# EAGLE design GBC USB-C Charging Kit Pro (EAGLE 6.2)
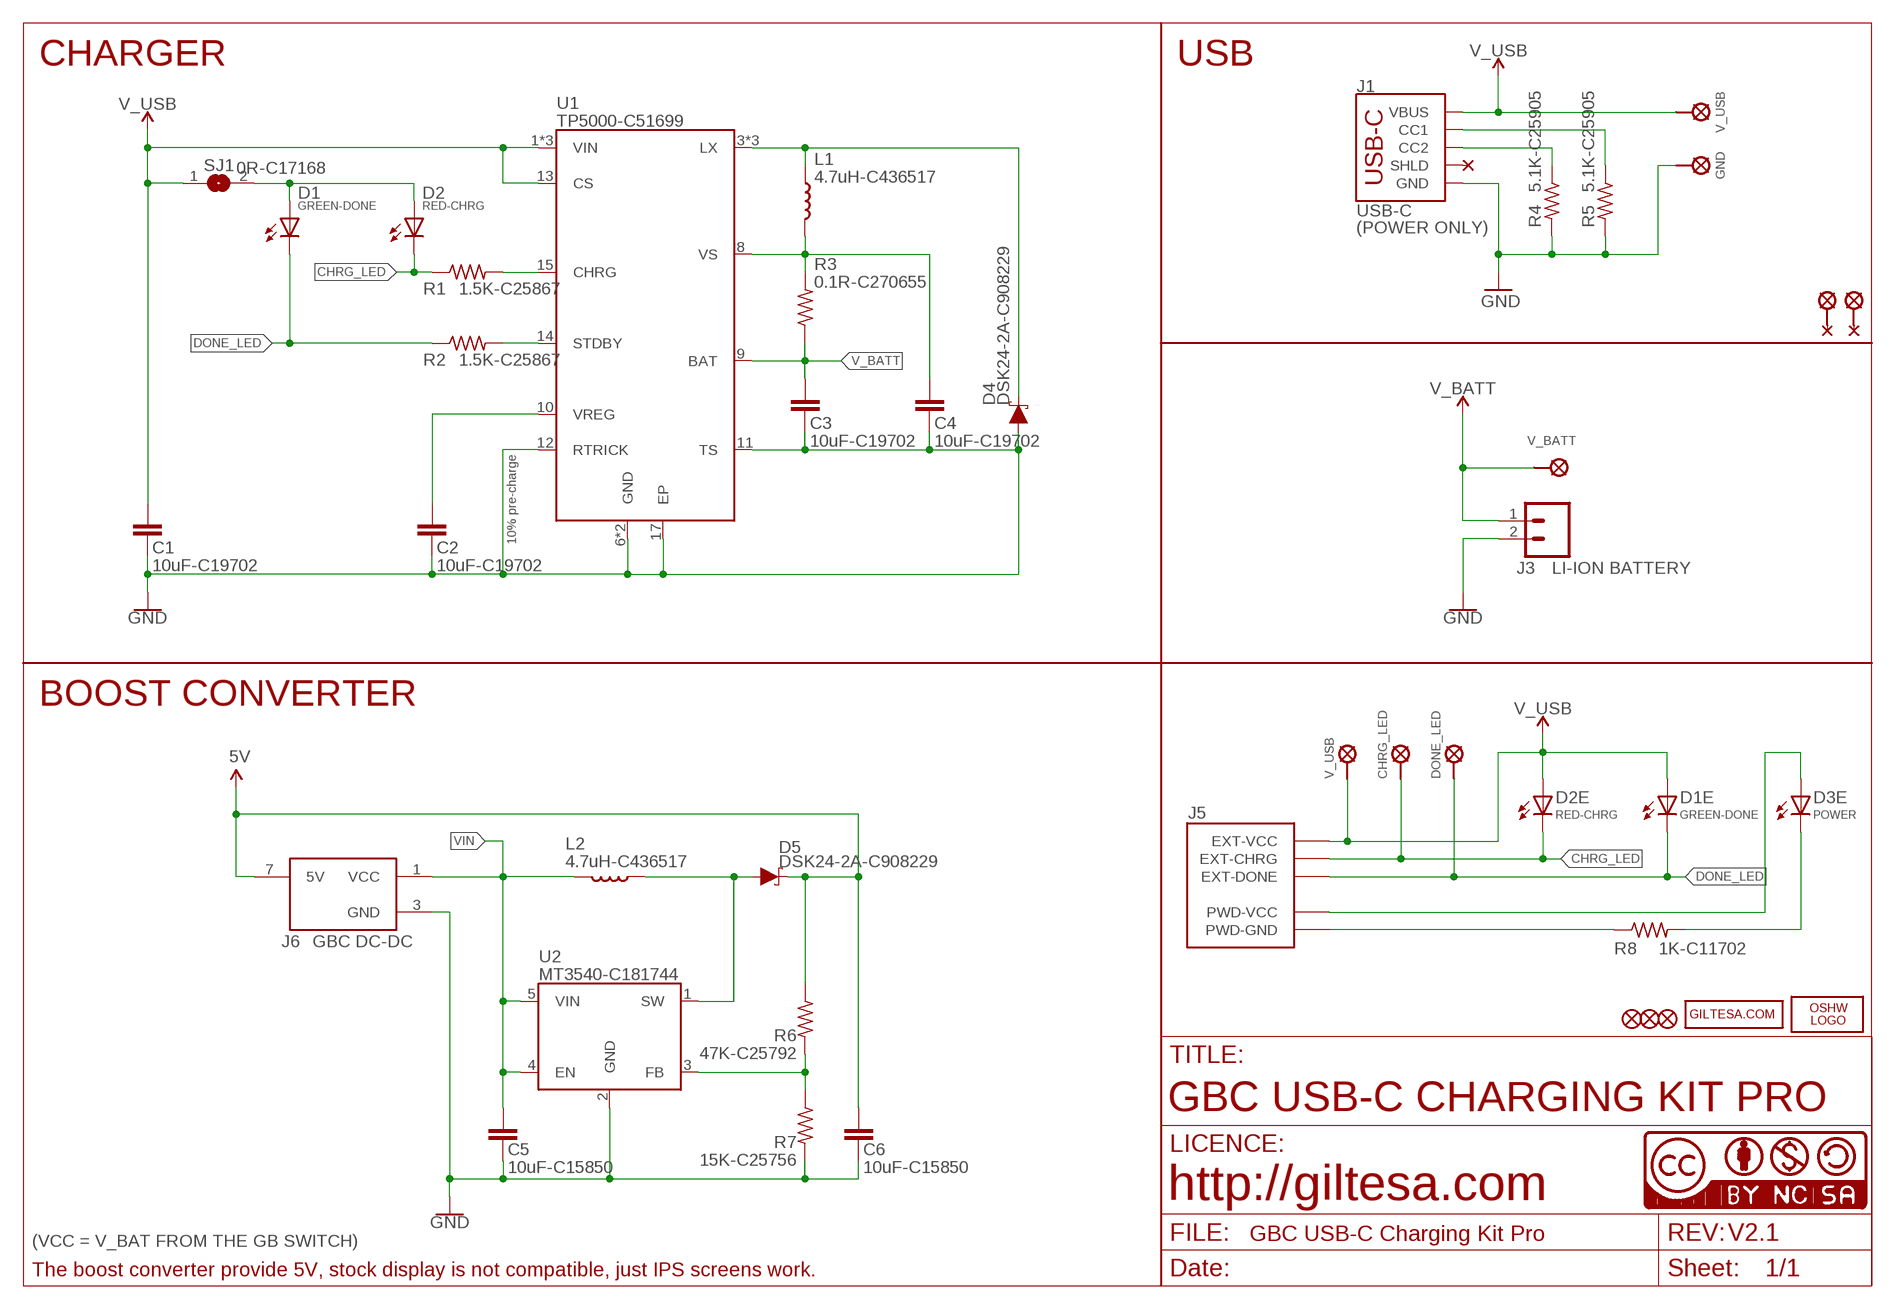
[diagram p0: schematic, sheet 1, part 1 of 2]
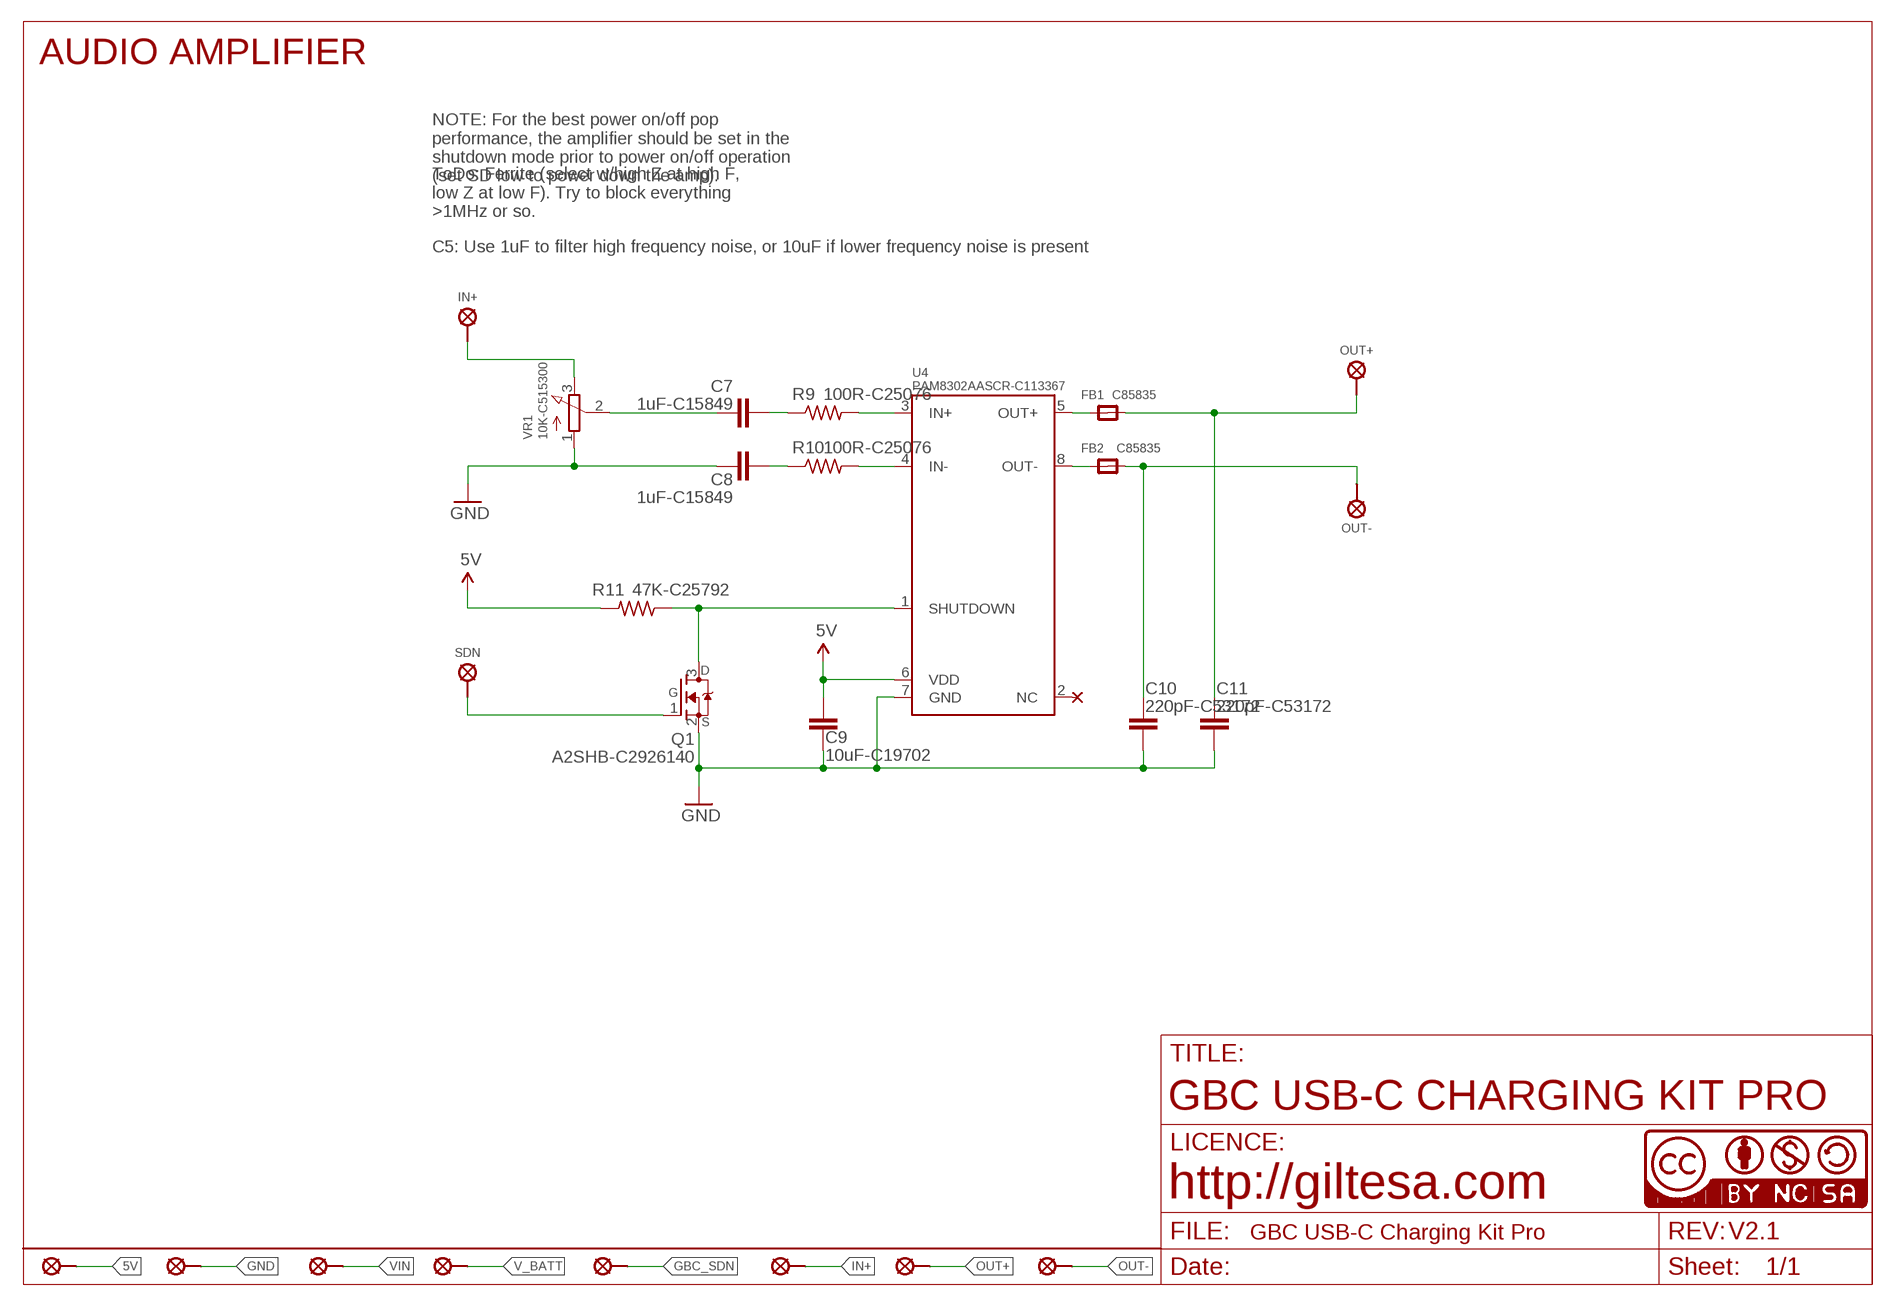
[diagram p1: schematic, sheet 1, part 2 of 2]

## Parts
C1  10uF-C19702  C0603_SMALL  [C0603_S]
C2  10uF-C19702  C0603_SMALL  [C0603_S]
C3  10uF-C19702  C0603_SMALL  [C0603_S]
C4  10uF-C19702  C0603_SMALL  [C0603_S]
C5  10uF-C15850  C0805_SMALL  [C0805_S]
C6  10uF-C15850  C0805_SMALL  [C0805_S]
C7  1uF-C15849  C0603_SMALL  [C0603_S]
C8  1uF-C15849  C0603_SMALL  [C0603_S]
C9  10uF-C19702  C0603_SMALL  [C0603_S]
C10  220pF-C53172  C0805_SMALL  [C0805_S]
C11  220pF-C53172  C0805_SMALL  [C0805_S]
D1  GREEN-DONE  L0402  [L0402]
D1E  GREEN-DONE  L0402  [L0402]
D2  RED-CHRG  L0402  [L0402]
D2E  RED-CHRG  L0402  [L0402]
D3E  POWER  L0402  [L0402]
D4  DSK24-2A-C908229  DIODE-SCHOTTKY_SOD-123FL  [SOD-123FL]
D5  DSK24-2A-C908229  DIODE-SCHOTTKY_SOD-123FL  [SOD-123FL]
FB1  C85835  MICROBUILDER_FERRITE_SMALL  [MICROBUILDER__0805MP_S]
FB2  C85835  MICROBUILDER_FERRITE_SMALL  [MICROBUILDER__0805MP_S]
FD2  FIDUCIALUFIDUCIAL  [FIDUCIAL-MICRO]
FD3  FIDUCIALUFIDUCIAL  [FIDUCIAL-MICRO]
FD4  FIDUCIALUFIDUCIAL  [FIDUCIAL-MICRO]
J1  USB-C  USB-CPOWER  [USB-C_6P]
J3  LI-ION BATTERY  JST-21MM  [JST-2-1MM-SMD_RIGHT]
J5  GBC_LED  [GBC_LED]
J6  GBC DC-DC  GBC_DC_DCDIP  [GBC_DC_DC_DIP]
L1  4.7uH-C436517  INDUCTOR_2  [PSPMAA0402]
L2  4.7uH-C436517  INDUCTOR_2  [PSPMAA0402]
LOGO2  OSHW_LOGO_FILLX0150-NT  [OSHW_FILLX150_NOTEXT]
PP1  SOLDER_PAD-1.5  [SOLDER_PAD_1.5]
PP2  SOLDER_PAD-1.5  [SOLDER_PAD_1.5]
PP3  SOLDER_PAD-1.5  [SOLDER_PAD_1.5]
PP4  SOLDER_PAD-1.5  [SOLDER_PAD_1.5]
PP5  SOLDER_PAD-1.5  [SOLDER_PAD_1.5]
PP6  SOLDER_PAD-1.5  [SOLDER_PAD_1.5]
PP7  SOLDER_PAD-1.5  [SOLDER_PAD_1.5]
PP8  SOLDER_PAD-1.5  [SOLDER_PAD_1.5]
Q1  A2SHB-C2926140  MOSFET-NCHANNEL_SMALL  [SOT23-3_S]
R1  1.5K-C25867  R0402  [R0402]
R2  1.5K-C25867  R0402  [R0402]
R3  0.1R-C270655  R0402  [R0402]
R4  5.1K-C25905  R0402  [R0402]
R5  5.1K-C25905  R0402  [R0402]
R6  47K-C25792  R0402  [R0402]
R7  15K-C25756  R0402  [R0402]
R8  1K-C11702  R0402  [R0402]
R9  100R-C25076  R0402  [R0402]
R10  100R-C25076  R0402  [R0402]
R11  47K-C25792  R0402  [R0402]
SJ1  0R-C17168  JUMPER-SMD0402  [JUMPER-SMD_0402]
U1  TP5000-C51699  TP5000  [QFN-16_4X4]
U2  MT3540-C181744  MT3540  [SOT-23-5]
U4  PAM8302AASCR-C113367  PAM8302A_ASCR  [PAM8302AASCR]
U$1  V_USB  SOLDER_PAD-1.5  [SOLDER_PAD_1.5]
U$2  SDN  PAD_1.0  [PAD_1.0]
U$3  GND  SOLDER_PAD-1.5  [SOLDER_PAD_1.5]
U$6  CC-BY-NC-SA15MM  [CC-BY-NC-SA_15MM]
U$9  SOLDER_PAD-2.5  [SOLDER_PAD_2.5]
U$16  GILTESA.COM_MASK  [GILTESA.COM_MASK]
U$17  CC-NC-BCNIX  [CC-NC-B_NIX]
U$20  OUT+  SOLDER_PAD-2.0  [SOLDER_PAD_2.0]
U$21  CC-NC-BCNIX  [CC-NC-B_NIX]
U$23  OUT-  SOLDER_PAD-2.0  [SOLDER_PAD_2.0]
U$24  CHRG_LED  SOLDER_PAD-1.3  [SOLDER_PAD_1.3]
U$25  DONE_LED  SOLDER_PAD-1.3  [SOLDER_PAD_1.3]
U$26  V_USB  SOLDER_PAD-1.3  [SOLDER_PAD_1.3]
U$29  V_BATT  PAD_1.25  [PAD_1.25]
U$30  IN+  SOLDER_PAD-1.3  [SOLDER_PAD_1.3]
U$32  SOLDER_PAD-2.5  [SOLDER_PAD_2.5]
VR1  10K-C515300  TRIMPOT3303W/X  [TRIMPOT_BOURNS_3303W]

## Nets
5V: C6.2 C9.1 D5.C J6.7(5V) PP1.P$1 R6.1 R11.2 U4.6(VDD)
CHRG_LED: D2.C D2E.C J5.EXT-CHRG R1.1 U$24.P$1
DONE_LED: D1.C D1E.C J5.EXT-DONE R2.1 U$25.P$1
GBC_SDN: PP5.P$1 Q1.1(G) U$2.P$1
GND: C1.1 C2.1 C3.1 C4.1 C5.1 C6.1 C8.2 C9.2 C10.2 C11.2 D4.A J1.GND1(GND) J1.GND2(GND) J3.2 J6.3(GND) PP2.P$1 Q1.2(S) R4.2 R5.2 R7.2 U1.6(GND) U1.7(GND) U1.11(TS) U1.12(RTRICK) U1.17(EP) U2.2(GND) U4.7(GND) U$3.P$1 VR1.1(A)
IN+: PP6.P$1 U$30.P$1 VR1.3(E)
N$1: D1.A D2.A SJ1.2
N$3: D5.A L2.P$1 U2.1(SW)
N$4: J1.B5(CC2) R4.1
N$6: R1.2 U1.15(CHRG)
N$7: R6.2 R7.1 U2.3(FB)
N$8: J5.PWD-GND R8.1
N$9: R10.2 U4.4(IN-)
N$10: D3E.A J5.PWD-VCC
N$11: D3E.C R8.2
N$12: R9.2 U4.3(IN+)
N$13: J1.A5(CC1) R5.1
N$16: C8.1 R10.1
N$17: FB2.1 U4.8(OUT-)
N$18: C2.2 U1.10(VREG)
N$19: R2.2 U1.14(STDBY)
N$20: C4.2 L1.P$2 R3.2 U1.8(VS)
N$21: D4.C L1.P$1 U1.3(LX) U1.4(LX) U1.5(LX)
N$22: FB1.1 U4.5(OUT+)
N$23: C7.1 R9.1
N$25: C7.2 VR1.2(S)
OUT+: C11.1 FB1.2 PP7.P$1 U$20.P$1
OUT-: C10.1 FB2.2 PP8.P$1 U$23.P$1
SDN: Q1.3(D) R11.1 U4.1(SHUTDOWN)
V_BATT: C3.2 J3.1 PP4.P$1 R3.1 U1.9(BAT) U$29.P$1
V_USB: C1.2 D1E.A D2E.A J1.VBUS1(VBUS) J1.VBUS2(VBUS) J5.EXT-VCC SJ1.1 U1.1(VIN) U1.2(VIN) U1.13(CS) U1.16(VIN) U$1.P$1 U$26.P$1
VIN: C5.2 J6.1(VCC) L2.P$2 PP3.P$1 U2.4(EN) U2.5(VIN)
Unconnected: J1.SHLD1(SHLD) J1.SHLD2(SHLD) J1.SHLD3(SHLD) J1.SHLD4(SHLD) J1.SHLD5(SHLD) J1.SHLD6(SHLD) J1.SHLD7(SHLD) J1.SHLD8(SHLD) U4.2(NC) U$9.P$1 U$32.P$1

## Notes on the sheet
- CHARGER | USB | AUDIO AMPLIFIER
- NOTE: For the best power on/off pop
  performance, the amplifier should be set in the
  shutdown mode prior to power on/off operation
  (set SD low to power down the amp).
- ToDo: Ferrite (select w/high Z at high F,
  low Z at low F). Try to block everything
  >1MHz or so.
- (POWER ONLY)
- C5: Use 1uF to filter high frequency noise, or 10uF if lower frequency noise is present
- 10% pre-charge
- D
- G
- BOOST CONVERTER
- S
- GBC USB-C CHARGING KIT PRO | GBC USB-C CHARGING KIT PRO
- http://giltesa.com | http://giltesa.com
- (VCC = V_BAT FROM THE GB SWITCH) | V2.1 | V2.1
- The boost converter provide 5V, stock display is not compatible, just IPS screens work.

## Library data of the parts
C1-C4 C7-C9 = ,giltesa:C0603
C5 C6 C10 C11 = ,giltesa:C0805
D1 D1E D2 D2E D3E = ,giltesa:L0402
D4 D5 = ,giltesa:DIODE-SCHOTTKY
FB1 FB2 = microbuilder:MICROBUILDER_FERRITE: Ferrite Bead 0603 MMZ1608B121C - 120 Ohm @ 100MHz, 600mA, 0.15 Ohm DC Resistance - Digikey: 445-2164-1-ND BK1608HW121-T - 120 Ohm, 600mA Ferrite Chip - Digikey: 587-1876-2-ND 0805 HZ0805B272R-10 - 2.7K Ohm @ 100MHz, 200mA, 0.8 Ohm DC Resistance - Digikey: 240-2504-1-ND (see also Murata BLM21BD272SN1L) MMZ2012Y152B - 1.5K Ohm @ 100MHz, 500mA, 0.4 Ohm DC Resistance - Digikey: 445-1560-1-ND - Mainly for high frequency (80-400MHz) MMZ2012R102A - 1K Ohm @ 100MHz, 500mA, 0.3 Ohm DC Resistance - Digikey: 445-1555-2-ND - More general purpose (10-200MHz)
FD2-FD4 = SparkFun-Aesthetics:FIDUCIAL: Fiducial Alignment Points Point-of-reference for pick-and-place machines and other optical instruments.
J1 = ,giltesa:USB-C
J3 = ,giltesa:JST-2
J5 = ,giltesa:GBC_LED
J6 = ,giltesa:GBC_DC_DC
L1 L2 = ,giltesa:INDUCTOR
LOGO2 = ohw-logo:OSHW_LOGO_FILL
PP1-PP8 U$1 U$3 U$9 U$20 U$23-U$26 U$30 U$32 = ,giltesa:SOLDER_PAD
Q1 = ,giltesa:MOSFET-NCHANNEL
R1-R11 = ,giltesa:R0402
SJ1 = ,giltesa:JUMPER-SMD
U1 = ,giltesa:TP5000
U2 = ,giltesa:MT3540
U4 = ,giltesa:PAM8302A
U$2 U$29 = ,giltesa:PAD
U$6 = ,giltesa_logos:CC-BY-NC-SA
U$16 = ,giltesa_logos:GILTESA.COM
U$17 U$21 = cc-by-nc-sa:CC-NC-BC: All hardware is licensed under the Creative Commons Attribution-Noncommercial-Share Alike 2.5 Switzerland License. To view a copy of this license, visit http://creativecommons.org/licenses/by-nc-sa/2.5/ch/ or send a letter to Creative Commons, 171 Second Street, Suite 300, San Francisco, California, 94105, USA.
VR1 = microbuilder:TRIMPOT: 3-Pin SMT Trimpots Bourns TC33 (X-2) Series 1K - Digikey: TC33X-102ECT-ND 10K - Digikey: TC33X-2-103E 100K - Digikey: TC33X-104ECT-ND Bourns 3303 (W) Series 3mm 10K Single Turn - Digikey: 3303W-103ETR-ND 3mm 100K Single Turn - Digikey: 3303X-104ETR-ND

## Net classes
1 power: width 0.61 mm, drill 0.406 mm, clearance 0.203 mm
2 gnd: width 0.305 mm, drill 0.406 mm, clearance 0.203 mm
3 power usb: width 0.508 mm, drill 0.406 mm, clearance 0.203 mm

## Board
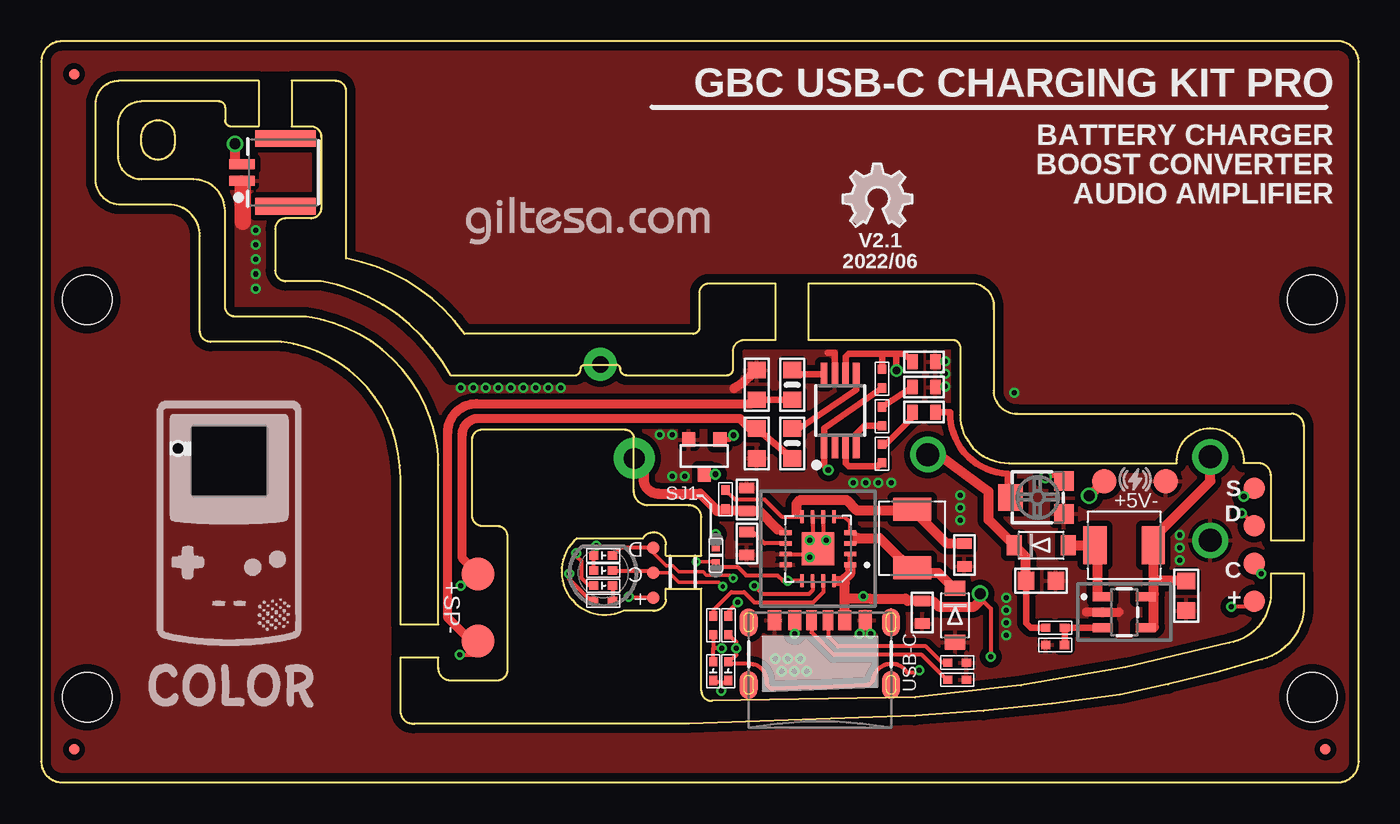
[diagram p2: board, top side]
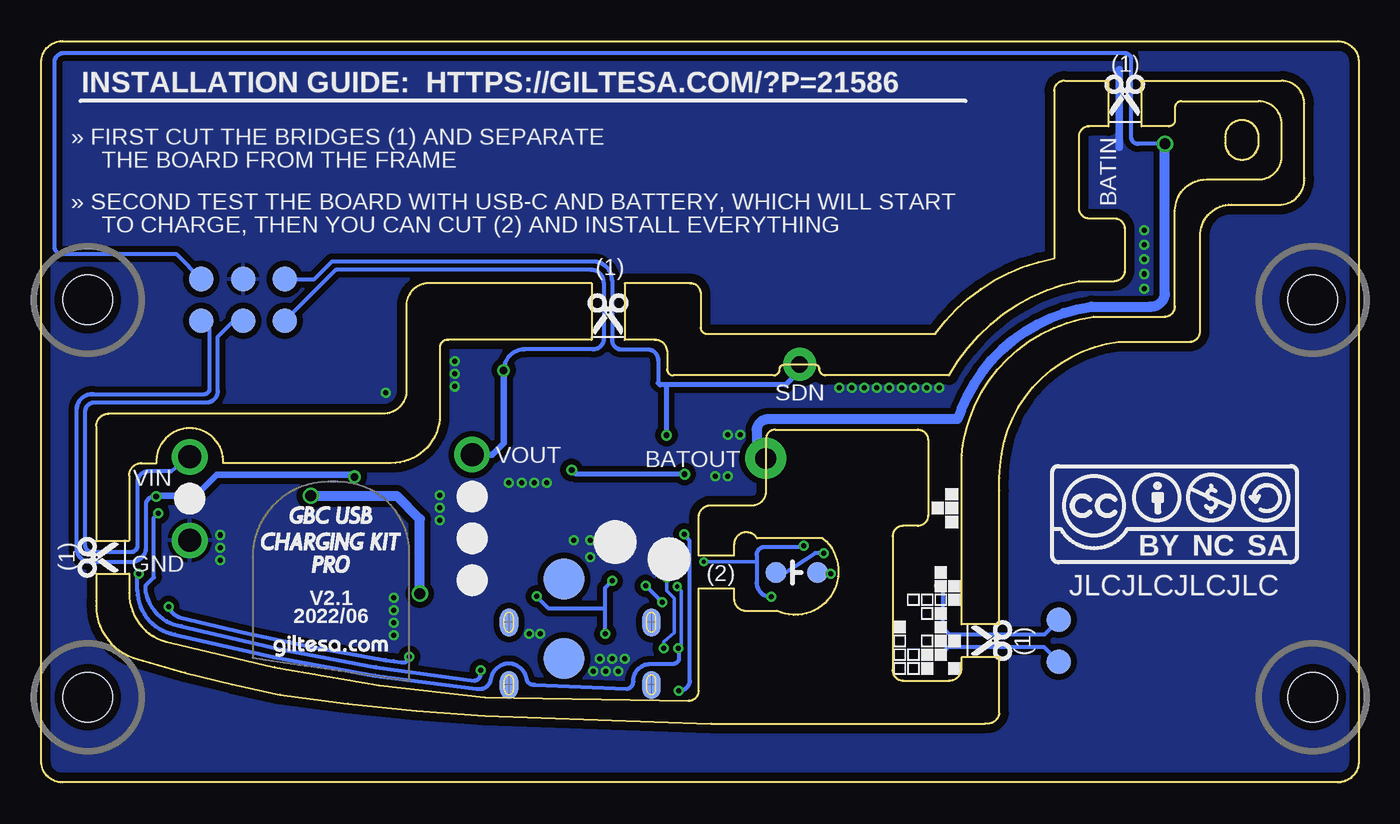
[diagram p3: board, bottom side, seen from below]

Size 80 x 45 mm. Coordinates in mm from the lower left corner, seen from the top.
Outline: 17,38.34 17,39.2 arc90 16.37,39.83 15.21,39.83 15.21,42.6 17.87,42.6 arc-90 18.5,41.98 18.5,31.81 arc-44 25.71,27.23 39.58,27.23 arc90 39.97,27.62 39.97,29.75 arc-90 40.6,30.29 44.58,30.29 44.58,26.86 42.76,26.86 arc90 42,26.19 42,25.08 arc-90 41.62,24.7 35.55,24.7 arc-90 35.16,25.1 arc90 34.91,25.35 33.01,25.35 arc90 32.75,25.1 arc-90 32.37,24.7 24.88,24.7 arc50 17,30.43 14.84,30.43 arc-90 14.21,31.07 14.21,33.61 arc-90 14.84,34.24 16.37,34.24 arc90 17,34.88 17,35.74
Outline: 17,38.39 17,35.76
Outline: 40.08,5.58 40.08,11.77 37.93,11.77 37.93,11.09 arc-90 37.13,10.42 35.33,10.42 arc-165 32.53,14.82 36.53,14.82 arc-149 37.93,14.44 37.93,13.77 40.08,13.77 40.08,16.12 arc90 39.31,16.82 36.78,16.82 arc-90 35.98,17.75 35.98,20.91 arc90 35.42,21.42 26.78,21.42 arc90 26.15,20.78 26.15,16.21 arc90 26.78,15.57 27.67,15.57 arc-90 28.31,14.94 28.31,6.81 arc-90 27.67,6.18 24.88,6.18 arc-90 24.11,6.94 24.11,7.59 21.83,7.59 21.83,4.2 arc90 22.69,3.57 39.34,3.57 53.06,4.04 arc5 65.51,5.32 arc5 74.12,7.46 arc80 76.66,11.01 76.66,12.67 74.66,12.67 74.66,11.51 arc-80 72.12,8.46 arc-10 53.06,5.16 40.72,4.94 arc-90 40.08,5.58
Outline: 46.58,26.86 55.28,26.86 arc-90 55.79,26.48 55.79,22.3 arc90 58.76,19.38 68.95,19.38 arc-185 73.01,19.38 73.9,19.38 arc-90 74.66,18.62 74.66,14.67 76.66,14.67 76.66,21.62 arc90 75.9,22.38 59.24,22.38 arc-90 57.82,23.78 57.82,28.73 arc90 56.65,30.29 46.58,30.29 46.58,26.86
Outline: 1.27,0 78.7,0 arc90 80,1.27 80,43.73 arc90 78.7,45 1.27,45 arc90 0,43.73 0,1.27 arc90 1.27,0
Outline: 23.61,22.18 arc62 16.11,28.27 11.8,28.27 arc-90 11.16,28.91 11.16,34.7 arc90 9.26,36.6 6.08,36.6 arc-90 4.68,38 4.68,39.96 arc-90 6.08,41.35 10.78,41.35 arc-90 11.16,40.97 11.16,40.21 arc90 11.54,39.83 13.21,39.83 13.21,42.6 4.71,42.6 arc90 3.31,41.2 3.31,36.68 arc90 4.71,35.08 7.73,35.08 arc-90 9.64,33.18 9.64,27.39 arc90 10.27,26.75 14.59,26.75 arc-62 21.32,21.42 arc-20 21.83,17.73 21.83,9.59 24.11,9.59 24.11,19.26 arc20 23.61,22.18
Outline: 6.08,39.2 arc-180 8.11,39.2 8.11,38.81 arc-180 6.08,38.81 6.08,39.2
Copper layers (1*16): Top 0.035mm / dielectric 1.6mm / Bottom 0.035mm
Design rules: minimum track width 6mil, minimum drill 12mil, track to track 6mil, track to pad 6mil, pad to pad 6mil, via to via 8mil, smd to smd 0mil, copper to edge 20mil, drill to drill 10mil, minimum pad ring 6mil, minimum via ring 6mil, stop-mask expansion 0mil, vias tented up to drill 100mil, thermal gap 10mil
Holes 3 mm at 77.17,29.29 2.8,29.29 2.8,5.16 77.17,5.16
tRestrict: area 74.6,12.4 to 74.7,14.9; area 21.6,7.2 to 21.7,9.7; area 76.7,12.4 to 76.9,14.9; area 9.4,17.6 to 13.4,21.4; area 12.9,42.7 to 15.5,42.8; area 44.3,30.4 to 46.8,30.5; area 44.2,26.6 to 46.7,26.8; area 8.4,20.3 to 8.4,20.3; 1 lines
bRestrict: area 74.6,12.4 to 74.7,14.9; area 21.6,7.2 to 21.7,9.7; area 76.7,12.4 to 76.9,14.9; area 44.3,30.4 to 46.8,30.5; area 44.2,26.6 to 46.7,26.8; 1 lines

### Footprints (pad centres in the part's own frame; a part is rotated, then mirrored left to right if it is on the bottom)
C0603_S = smd 0.635 x 0.9: 1 -0.694,0; 2 0.694,0
C0805_S = smd 1 x 1.1: 1 -0.901,0; 2 0.901,0
L0402 = smd 0.559 x 0.5: A -0.567,0; C 0.567,0
SOD-123FL = smd 0.91 x 1.22: A -1.637,0; C 1.637,0
MICROBUILDER__0805MP_S = smd 1 x 1.1: 1 -0.901,0; 2 0.901,0
FIDUCIAL-MICRO = smd 0.635 x 0.635: 1 0,0
USB-C_6P = smd 0.635 x 1.2: A5 -0.5,-0.017; B5 0.5,-0.017 | smd 0.8 x 1.2: GND1 -2.75,-0.017; GND2 2.75,-0.017; VBUS1 -1.52,-0.017; VBUS2 1.52,-0.017 | smd 1.1 x 1.7: SHLD1 -4.32,-0.15; SHLD2 4.32,-0.15; SHLD5 -4.32,-3.95; SHLD8 4.32,-3.95 | smd 1.1 x 1.7 bottom: SHLD3 -4.32,-0.15; SHLD4 4.32,-0.15; SHLD6 -4.32,-3.95; SHLD7 4.32,-3.95
JST-2-1MM-SMD_RIGHT = smd 0.6 x 1.524: 1 -0.5,-2.017; 2 0.5,-2.017 | smd 1.016 x 3.683: NC1 -2.054,0.635; NC2 2.054,0.635
GBC_LED = smd 0.762 x 0.762: EXT-CHRG -3.048,0; EXT-DONE -3.048,-1.524; EXT-VCC -3.048,1.524 | smd 1.27 x 1.27 bottom: PWD-GND 1.27,0; PWD-VCC -1.27,0
GBC_DC_DC_DIP = drill 1.397 pad 2.159: 1 17.145,7.493; 3 17.145,2.413; 7 0,7.62
PSPMAA0402 = smd 1.4 x 2.3: P$1 -1.775,0; P$2 1.775,0
SOLDER_PAD_1.5 = smd 1.5 x 1.5: P$1 0,0
SOT23-3_S = smd 0.8 x 0.9: 1 -0.95,-1; 2 0.95,-1; 3 0,1.1
R0402 = smd 0.559 x 0.5: 1 -0.567,0; 2 0.567,0
JUMPER-SMD_0402 = smd 0.635 x 0.5: 1 -0.559,0; 2 0.559,0
QFN-16_4X4 = smd 0.81 x 0.3: 1 -1.95,0.975; 2 -1.95,0.325; 3 -1.95,-0.325; 4 -1.95,-0.975; 9 1.95,-0.975; 10 1.95,-0.325; 11 1.95,0.325; 12 1.95,0.975 | smd 0.3 x 0.81: 5 -0.975,-1.95; 6 -0.325,-1.95; 7 0.325,-1.95; 8 0.975,-1.95; 13 0.975,1.95; 14 0.325,1.95; 15 -0.325,1.95; 16 -0.975,1.95 | smd 2 x 2: 17 0,0
SOT-23-5 = smd 0.55 x 1.2: 1 -0.95,-1.3; 2 0,-1.3; 3 0.95,-1.3; 4 0.95,1.3; 5 -0.95,1.3
PAM8302AASCR = smd 0.4 x 1.4: 1 -0.975,-2.2; 2 -0.325,-2.2; 3 0.325,-2.2; 4 0.975,-2.2; 5 0.975,2.2; 6 0.325,2.2; 7 -0.325,2.2; 8 -0.975,2.2
PAD_1.0 = drill 1 pad 2: P$1 0,0
SOLDER_PAD_2.5 = smd 2.5 x 2.5: P$1 0,0
SOLDER_PAD_2.0 = smd 2 x 2: P$1 0,0
SOLDER_PAD_1.3 = smd 1.3 x 1.3: P$1 0,0
PAD_1.25 = drill 1.25 pad 2.5: P$1 0,0
TRIMPOT_BOURNS_3303W = smd 1.2 x 1.2: 1 -1,-1.6; 3 1,-1.6 | smd 1.6 x 1.5: 2 0,1.65

### Placement (x,y rotation side)
C1  53.49,10.33 90 top
C2  42.84,14.5 90 top
C3  42.84,17.18 270 top
C4  56.05,13.8 90 top
C5  69.51,11.33 90 top
C6  60.71,12.24 180 top
C7  53.61,22.48 0 top
C8  53.59,24 0 top
C9  53.59,25.53 0 top
C10  43.43,24.13 90 top
C11  43.43,20.57 270 top
D1  41.72,6.75 90 top
D1E  34.12,13.77 0 top
D2  40.81,6.75 90 top
D2E  34.12,12.86 0 top
D3E  34.12,11.95 0 top
D4  55.48,10.14 90 top
D5  60.71,14.4 180 top
FB1  45.59,20.57 270 top
FB2  45.59,24.13 270 top
FD2  2,43 0 top
FD3  77.97,2 0 top
FD4  2,2 0 top
J1  47.28,9.87 0 top
J3  14.21,37.04 270 top
J5  34.12,12.73 180 top
J6  53.83,12.27 0 top
L1  52.88,14.82 90 top
L2  65.76,14.4 0 top
LOGO2  48.65,33.75 0 top
PP1  65.2,28.02 0 bottom
PP2  67.75,30.56 0 bottom
PP3  67.75,28.02 0 bottom
PP4  70.28,30.56 0 bottom
PP5  65.2,30.56 0 bottom
PP6  70.28,28.02 0 bottom
PP7  18.21,9.86 0 bottom
PP8  18.21,7.32 0 bottom
Q1  40.26,19.81 180 top
R1  40.81,9.53 90 top
R2  41.72,9.53 90 top
R3  41.55,17.18 90 top
R4  55.61,7.27 0 top
R5  55.61,6.23 0 top
R6  61.57,9.38 0 top
R7  61.57,8.34 180 top
R8  34.12,11.03 0 top
R9  51.05,19.96 270 top
R10  51.05,22.23 270 top
R11  51.05,24.51 90 top
SJ1  40.96,13.79 90 top
U1  47.16,14.18 180 top
U2  65.76,10.33 270 top
U4  48.51,22.59 0 top
U$1  64.55,18.29 180 top
U$2  33.94,25.38 0 top
U$3  68.29,18.29 180 top
U$6  18.74,13.24 0 bottom
U$7  [GAME_BOY_COLOR_1.2]  6.52,4.55 0 top
U$8  [SCISSOR]  45.57,27.19 90 bottom
U$9  48.27,12.35 0 bottom
U$10  [TETRIS]  24.05,6.43 0 top
U$13  [SCISSOR]  14.2,40.46 90 bottom
U$14  [SCISSOR]  23.55,8.6 0 bottom
U$15  [SCISSOR]  75.29,13.67 180 bottom
U$16  25.7,32.59 0 top
U$17  0,0 0 top
U$19  [QI]  66.42,18.4 180 top
U$20  26.53,12.65 0 top
U$21  0,0 0 top
U$23  26.53,8.59 0 top
U$24  73.64,13.29 0 top
U$25  73.64,15.57 0 top
U$26  73.64,11 0 top
U$28  [GAME_BOY_COLOR_2]  7.02,8.21 0 top
U$29  36.01,19.67 0 top
U$30  73.64,17.86 0 top
U$32  48.27,7.52 0 bottom
U$33  [GILTESA.COM_MASK_7MM]  65.9,7.57 0 bottom
U$34  [GAME_BOY_COLOR_USB_CHARGING_KIT_PRO]  66.66,12.65 0 bottom
VR1  60.5,17.3 90 top

### Tracks (layer width: path | path; a pad name or v marks a point on that pad's centre or on a via)
5V  (via drill 0.46)
  Top 0.406: R6.1 60.09,9.38 59.8,9.66 C6.2 | U4.6 48.84,25.85 49.02,26.04 51.18,26.04 | 51.18,26.04 51.92,26.04 | 51.92,26.04 52.39,26.04 C9.1 | 51.18,26.04 51.05,25.91 R11.2 | v51.92,25.02 51.92,26.04
  Top 0.61: C6.2 59.77,12.24 59.77,13.69 D5.C 57.53,15.93 57.53,17.65 54.48,19.89 J6.7
  Bottom 0.254: 65.01,28.08 65.01,28.02 PP1.P$1 62.11,31.11 46.61,31.11 arc90 45.85,30.35 45.85,26.92 arc90 46.48,26.29 50.65,26.29 arc-90 v51.92,25.02
  Bottom 0.406: J6.7 52.6,19.89 51.92,20.57 v51.92,25.02
CHRG_LED  (via drill 0.25, 0.3)
  Top 0.203: v41.39,11.89 41.13,12.15 38.72,12.15 38.13,12.73 J5.EXT-CHRG 37.24,12.73
  Top 0.254: D2.C 40.81,8.16 | 40.81,8.16 41.3,8.16 v41.32,8.13 | D2E.C 37.04,12.86 J5.EXT-CHRG | U$24.P$1 v74.09,12.65 | R1.1 40.81,8.16
  Bottom 0.203: v41.39,11.89 41.13,11.64 41.13,8.37 v41.32,8.13
  Bottom 0.254: v74.09,12.65 74.15,12.59 74.15,11.64 arc-80 71.87,8.97 arc-8 53.58,5.67 53.33,5.67 arc-80 52.69,6.3 arc160 50.53,6.3 arc-80 50.15,5.92 50.02,5.92 44.44,5.67 arc-85 44.05,6.18 arc87 43.04,7.19 41.64,7.19 arc-90 41.26,7.57 41.26,8.12 v41.32,8.13
DONE_LED  (via drill 0.25, 0.3)
  Top 0.203: v42.02,12.4 41.84,12.58 40.38,12.58 40.18,12.78 38.72,12.78 38.34,13.16 37.96,13.16 37.17,13.95 J5.EXT-DONE
  Top 0.254: J5.EXT-DONE 35.18,14.26 D1E.C | 73.64,15.45 U$25.P$1 73.64,15.7 v72.88,16.34 | v53.33,6.81 53.2,6.68 52.56,6.68 arc138 50.53,6.3 arc-90 50.02,5.92 46.72,5.77 44.44,5.67 arc-90 44.05,6.18 arc88 43.04,7.19 41.83,7.19 D1.C 42.21,7.73 v42.21,8.13 42.21,8.53 R2.1
  Bottom 0.203: v42.21,8.13 42.21,8.53 41.58,9.1 41.58,11.19 42.02,11.64 v42.02,12.4
  Bottom 0.254: 53.33,6.68 v53.33,6.81 53.33,6.56 arc90 53.71,6.18 arc8 71.49,9.48 arc70 73.64,11.51 73.64,11.95 73.15,12.45 73.15,16.07 v72.88,16.34
GBC_SDN  (via drill 0.36)
  Top 0.305: Q1.1 41.23,20.83 41.78,20.83 v42.04,21.08
  Bottom 0.254: PP5.P$1 63.42,30.56 62.36,31.62 46.48,31.62 arc90 45.34,30.48 45.34,26.92 arc-90 44.83,26.29 43.18,26.29 arc90 42.55,25.65 42.55,24.26
  Bottom 0.305: U$2.P$1 33.95,24.98 34.8,24.13 42.04,24.13 | 42.04,24.13 42.42,24.13 42.55,24.26 | 42.04,24.13 v42.04,21.08
GND  (via drill 0.3)
  Top 0.254: U1.11 46.84,13.86 | U1.6 47.49,14.73 | 47.49,14.73 47.49,14.61 | v47.67,14.69 47.53,14.69 47.49,14.73 | U1.7 46.84,14.51 U1.17
  Top 0.406: 46.84,13.86 47.49,13.86 47.49,14.51 | 47.49,14.51 47.49,14.61 | 47.49,14.51 47.16,14.51 U1.17 | U4.7 48.19,26.08 48.01,26.08 47.75,26.08
  Top 0.559: 63.45,10.33 U2.2 65.45,10.33 | 43.32,25.03 arc-30 42.06,23.93
  Top 0.711: C10.2 43.32,25.03
  Top 1.016: 12.25,34.04 12.25,36.22
  Bottom 0.457: 14.54,43.26 14.54,38.56
  other vias: 25.46,23.96 26.22,23.96 26.99,23.96 27.75,23.96 28.51,23.96 29.27,23.96 30.03,23.96 30.8,23.96 31.56,23.96 13.02,33.53 13.02,32.64 13.02,31.75 13.02,30.86 13.02,29.98 44.57,7.5 45.34,7.5 46.1,7.5 44.96,6.73 45.72,6.73 46.48,6.73 49.69,9.02 50.35,9.02 46.66,14.69 46.66,13.67 58.58,9.68 54.9,25.56 54.9,24.8 54.9,24.04 59.09,23.65 58.58,10.45 58.58,11.21 58.58,8.92 69.12,15.02 69.12,14.26 69.12,13.49 49.31,18.19 50.07,18.19 50.84,18.19 51.6,18.19 37.55,21.11 38.31,21.11 39.08,18.57 38.31,18.57 55.79,17.43 55.79,16.67 55.79,15.91
  pour Top (isolate 0.356): -2,47 81.97,47 81.97,-2 -2,-2
  pour Bottom (isolate 0.356): -2,47 81.97,47 81.97,-2 -2,-2
IN+  (via drill 0.36, 0.46)
  Top 0.254: v73.01,17.35 73.52,17.86 U$30.P$1
  Top 0.406: VR1.3 62.1,18.43 61.85,18.68 61.1,18.68 v60.97,18.55
  Bottom 0.254: v73.01,17.35 73.14,17.35 arc-90 73.64,16.84 73.64,14.26 arc90 74.53,13.37 76.95,13.37 arc90 77.84,14.13 77.84,22.69 arc90 76.82,23.57 70.09,23.57 arc-90 69.78,23.89 69.78,27.51 PP6.P$1
  Bottom 0.406: v73.01,17.35 72.96,17.4 70.61,17.4 69.33,18.68 61.1,18.68 v60.97,18.55
N$1  (via drill 0.3)
  Top 0.254: 41.28,6.07 v41.28,5.55 | SJ1.2 v40.96,15.07 | 41.28,6.07 41.72,6.07 D1.A | 41.28,6.07 40.83,6.07 D2.A
  Bottom 0.254: v41.28,5.55 arc-90 40.62,6.2 40.62,14.66 v40.96,15.07
N$3
  Top 0.508: U2.1 64.28,11.28 64.16,11.43
  Top 0.61: D5.A L2.P$1 64.16,14.24 64.16,11.43
N$4
  Top 0.254: J1.B5 47.78,8.87 48.39,8.26 53.72,8.26 54.71,7.27 R4.1
N$6
  Top 0.254: 47.5,11.97 U1.15 47.49,11.55 46.86,10.92 43.31,10.92 42.67,11.56 41.91,11.56 40.83,10.48 R1.2
N$7
  Top 0.406: U2.3 R6.2 R7.1
N$8  (via drill 0.3)
  Top 0.254: R8.1 33.31,11.08 32.05,12.34 v32.05,12.65
  Bottom 0.254: J5.PWD-GND 32.07,12.73 v32.05,12.65
N$9
  Top 0.406: R10.2 49.98,21.66 49.49,21.17 U4.4
N$10  (via drill 0.3)
  Top 0.254: D3E.A 33.24,11.97 32.81,12.4 32.81,13.41 32.5,13.73 v32.5,13.92
  Bottom 0.254: v32.5,13.92 33.01,13.92 34.83,12.73 J5.PWD-VCC
N$11
  Top 0.254: D3E.C R8.2
N$12
  Top 0.406: R9.2 51.02,19.4 50.8,19.18 49.02,19.18 48.84,19.36 U4.3
N$13
  Top 0.254: J1.A5 46.78,9.1 48.13,7.75 53.47,7.75 54.99,6.23 R5.1
N$16
  Top 0.406: R10.1 C8.1
N$17
  Top 0.406: U4.8 45.84,24.79 FB2.1
N$18
  Top 0.254: U1.10 43.91,14.51 43.23,15.19 C2.2
N$19  (via drill 0.3)
  Top 0.254: U1.14 46.84,11.66 46.61,11.43 43.81,11.43 v43.31,11.94 | R2.2 41.72,10.35 v42.29,10.92
  Bottom 0.254: v43.31,11.94 v42.29,10.92
N$20
  Top 0.254: 41.56,17.75 R3.2 42.11,17.18 43.91,17.18 44.96,16.13 U1.8 45.99,16.33 45.85,16.33
  Top 0.61: 45.85,16.33 45.85,16.89 46.1,17.14 48.9,17.14 49.53,16.51 52.8,16.51 L1.P$2 54.98,14.49 C4.2
N$21
  Top 0.254: U1.3 49.41,14.51 49.73,14.83 49.41,15.16 U1.4 49.11,15.78 48.77,16.13 U1.5 | 49.38,14.68 49.38,15.09 49.58,14.88 49.58,14.83 49.38,14.68 | 49.38,14.53 49.38,14.68
  Top 0.305: 49.73,14.83 49.58,14.83
  Top 0.61: 49.58,14.83 50.91,14.83 52.2,13.55 52.2,13.08 52.24,13.04 L1.P$1 53.22,12.7 54.48,12.7 55.23,11.96 D4.C
N$22
  Top 0.406: U4.5 49.49,23.84 46.35,21.72 45.99,21.48 FB1.1
N$23
  Top 0.406: R9.1 51.27,20.53 52.91,22.18 C7.1
N$25
  Top 0.406: C7.2 55.19,22.48 arc90 58.67,18.75 58.67,17.3 VR1.2
OUT+  (via drill 0.3)
  Top 0.254: v25.46,11.94 26.18,12.65 U$20.P$1
  Top 0.406: FB1.2 C11.1
  Top 0.559: U$20.P$1 25.58,13.61 25.58,21.13 arc-90 26.54,22.1 42.42,22.1 43.05,21.46 C11.1
  Top 0.61: U$20.P$1 26.34,12.65
  Bottom 0.254: PP7.P$1 19.11,8.97 24.84,8.97 25.27,9.4 25.27,11.75 v25.46,11.94
OUT-  (via drill 0.3)
  Top 0.254: v25.4,7.75 26.54,7.75 26.54,8.58 U$23.P$1
  Top 0.406: FB2.2 C10.1
  Top 0.559: 26.08,8.59 24.69,9.98 24.69,21.26 arc-90 26.42,22.99 43.18,22.99 C10.1
  Top 0.61: U$23.P$1 26.08,8.59
  Bottom 0.254: PP8.P$1 19.1,8.21 24.94,8.21 v25.4,7.75
SDN  (via drill 0.36)
  Top 0.305: Q1.3 v40.94,18.71
  Top 0.406: R11.1 50.04,23.24 47.54,21.5 U4.1 47.54,19.22 v47.79,18.96
  Bottom 0.305: v40.94,18.71 47.54,18.71 v47.79,18.96
V_BATT  (via drill 0.66)
  Top 0.254: U1.9 44.66,15.16 44.58,15.24 44.7,15.37 | 44.7,15.37 44.83,15.49 45.09,15.24 44.83,15.24 44.7,15.37
  Top 0.305: 41.05,16.48 41.42,16.48 R3.1
  Top 0.61: J3.1 11.73,37.54 11.77,37.6 v11.77,38.76 | U$29.P$1 36.08,19.67 36.58,19.18 36.58,18.41 arc90 37.47,17.53 40.01,17.53 41.05,16.48 C3.2 43.59,16.48 44.7,15.37
  Bottom 0.254: v11.77,38.76 13.39,38.76 arc90 13.83,39.2 13.83,43.9 arc-90 14.21,44.28 78.62,44.28 arc-90 79.2,43.7 79.2,32.53 arc-90 78.75,32.08 71.81,32.08 PP4.P$1
  Bottom 0.61: v11.77,38.76 11.77,29.67 arc90 12.69,28.88 16.24,28.88 arc-60 24.11,22.69 24.37,22.05 35.93,22.05 arc-80 36.56,21.42 36.56,20.23 U$29.P$1
V_USB  (via drill 0.25, 0.3, 0.66)
  Top 0.203: 40.89,13.34 40.89,13.23 SJ1.1 40.96,13.39 v39.78,13.39
  Top 0.254: J5.EXT-VCC 35.72,11.21 v35.67,11.26 | D2E.A D1E.A 33.56,14.22 v33.7,14.37 | U1.16 48.3,12.23 | U1.1 49.11,12.99 | U1.13 v45.34,12.23 45.05,12.23 44.7,12.57 42.8,12.57 42.29,13.08 41.15,13.08 41.02,13.21 40.99,13.21 SJ1.1 | J1.VBUS1 v45.76,9.02 | v49.91,11.3 50.29,11.15 | U$26.P$1 73.61,11 73.28,10.67 v72.26,10.67 | v57.01,11.46 57.01,11.19 57.66,10.54 v57.66,7.62
  Top 0.305: U1.1 U1.2
  Top 0.61: 48.3,12.23 48.68,12.23 | 48.68,12.23 49.11,12.66 49.11,12.99 | J1.VBUS2 48.8,11.05 | 48.8,11.05 48.8,12.12 48.68,12.23 | 48.8,11.05 48.83,11.15 50.29,11.15 52.48,11.15 52.61,11.02 C1.2 54.13,11.02 54.48,10.67 56.64,10.67 57.01,11.03 v57.01,11.46 | v63.63,17.4 63.66,17.4 U$1.P$1
  Bottom 0.203: v39.78,13.39 36.56,13.39 36.56,13.34
  Bottom 0.254: 45.76,10.54 49.18,10.54 49.91,11.28 v49.91,11.3 | v45.76,9.02 45.76,10.54 | 45.76,10.54 45.76,11.81 v45.34,12.23 | v72.26,10.67 arc-50 71.63,10.03 arc-5 59.56,7.49 arc0 58.12,7.29 arc-104 v57.66,7.62 | v33.7,14.37 33.77,14.3 36.05,14.3 arc-90 36.56,13.8 36.56,13.34 36.56,12.14 arc-90 v35.67,11.26
  Bottom 0.61: v57.01,11.46 57.01,15.99 58.42,17.4 v63.63,17.4
VIN
  Top 0.508: U2.4 67.42,9.38 67.56,9.42 | U2.5 67.42,11.28 67.56,11.43
  Top 0.61: 67.56,9.42 67.56,11.43 67.56,12.19 | 67.56,12.19 67.56,14.36 L2.P$2 67.53,14.83 70.99,18.29 70.99,19.75 J6.1 | C5.2 67.6,12.23 67.56,12.19
  Bottom 0.254: PP3.P$1 68.31,28.02 69.27,27.06 69.27,23.76 arc90 69.96,23.07 76.69,23.07 arc-90 77.33,22.56 77.33,14.36 arc-90 76.85,13.98 74.56,13.98 arc-90 74.15,14.36 74.15,18.24 arc90 73.52,18.88 72.12,18.88 J6.1

### Text on the board
tPlace: GBC USB-C CHARGING KIT PRO | BATTERY CHARGER | BOOST CONVERTER | AUDIO AMPLIFIER | V2.1 | 2022/06 | S | +5V- | D | D | C | C | +SP- | + | +
bPlace: (1) | INSTALLATION GUIDE: HTTPS://GILTESA.COM/?P=21586 | » FIRST CUT THE BRIDGES (1) AND SEPARATE | THE BOARD FROM THE FRAME | BATIN | » SECOND TEST THE BOARD WITH USB-C AND BATTERY, WHICH WILL START | TO CHARGE, THEN YOU CAN CUT (2) AND INSTALL EVERYTHING | (1) | SDN | BATOUT | VOUT | VIN | (1) | (2) | GND | JLCJLCJLCJLC | V2.1 | 2022/06 | (1)
Measures: 0.0562248995983936